# EAGLE design mainboard.pa3 (EAGLE 4.11)
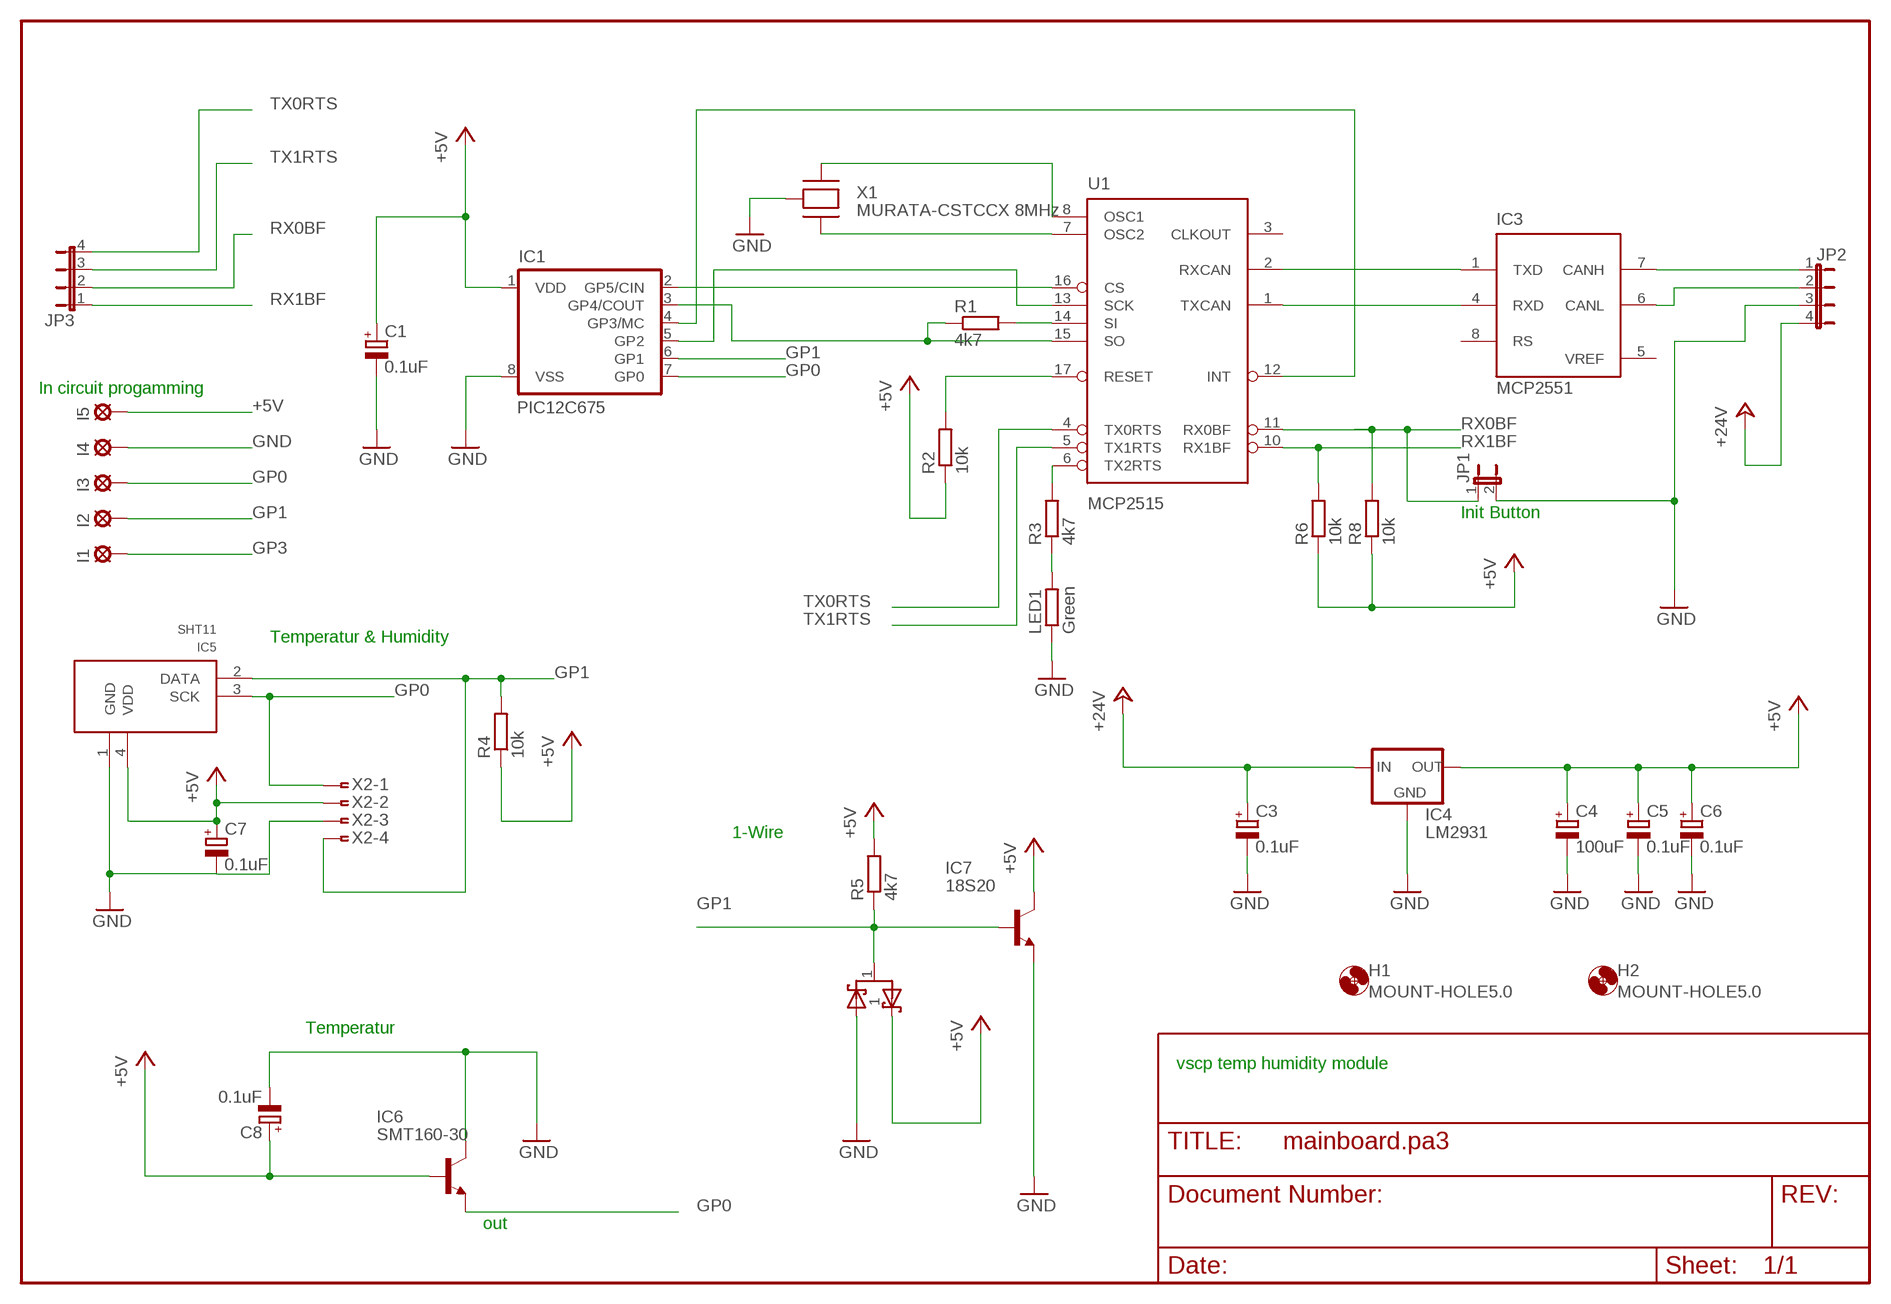
[diagram p0: schematic, sheet 1]

## Parts
C1  0.1uF  CPOL-EUCT3216  [CT3216]
C3  0.1uF  CPOL-EUCT3216  [CT3216]
C4  100uF  CPOL-EUCT7343  [CT7343]
C5  0.1uF  CPOL-EUCT3216  [CT3216]
C6  0.1uF  CPOL-EUCT3216  [CT3216]
C7  0.1uF  CPOL-EUCT3216  [CT3216]
C8  0.1uF  CPOL-EUCT3216  [CT3216]
H1  MOUNT-HOLE5.0  [5,0]
H2  MOUNT-HOLE5.0  [5,0]
I1  LSP10  [LSP10]
I2  LSP10  [LSP10]
I3  LSP10  [LSP10]
I4  LSP10  [LSP10]
I5  LSP10  [LSP10]
IC1  PIC12C675  PIC12C672SM  [SO-08M]
IC3  MCP2551  MCP2551SN  [SO-08]
IC4  LM2931  78LXX  [78LXX]
IC5  SHT11  SHT1X  [SHT1X]
IC6  SMT160-30  BC547  [TO92]
IC7  18S20  BC547  [TO92]
JP1  JP1E  [JP1]
JP2  JP4E  [JP4]
JP3  JP4E  [JP4]
LED1  Green  R-EU_R1206  [R1206]
R1  4k7  R-EU_R0805  [R0805]
R2  10k  R-EU_R0805  [R0805]
R3  4k7  R-EU_R0805  [R0805]
R4  10k  R-EU_R0805  [R0805]
R5  4k7  R-EU_R0805  [R0805]
R6  10k  R-EU_R0805  [R0805]
R8  10k  R-EU_R0805  [R0805]
U1  MCP2515  MCP2510SO  [SO-18W]
U$1  BAT54SCT  [SOT23]
X1  MURATA-CSTCCX 8MHz  MURATA-CSTCCX  [RESONATOR-MURATA-CSTCCX]
X2  FTOP-4  [FTOP-4]

## Nets
+5V: C1.+ C4.+ C5.+ C6.+ C7.+ C8.+ I5.MP IC1.1(VDD) IC4.OUT IC5.4(VDD) IC6.2(B) IC7.3(C) R2.1 R4.1 R5.2 R6.1 R8.1 U$1.2 X2.2
+24V: C3.+ IC4.IN JP2.4
GND: C1.- C3.- C4.- C5.- C6.- C7.- C8.- I4.MP IC1.8(VSS) IC4.GND IC5.1(GND) IC6.3(C) IC7.1(E) JP1.2 JP2.3 LED1.1 U$1.3 X1.3(GND) X2.3
GP0: I3.MP IC1.7(GP0) IC5.3(SCK) IC6.1(E) X2.1
GP1: I2.MP IC1.6(GP1) IC5.2(DATA) IC7.2(B) R4.2 R5.1 U$1.1 X2.4
GP2: IC1.5(GP2) U1.13(SCK)
GP3: I1.MP IC1.4(GP3/MC) U1.12(INT)
GP4: IC1.3(GP4/COUT) R1.1 U1.15(SO)
GP5: IC1.2(GP5/CIN) U1.16(CS)
N$1: IC3.1(TXD) U1.2(RXCAN)
N$2: IC3.4(RXD) U1.1(TXCAN)
N$3: R2.2 U1.17(RESET)
N$4: IC3.7(CANH) JP2.1
N$5: IC3.6(CANL) JP2.2
N$7: R1.2 U1.14(SI)
N$10: LED1.2 R3.1
OSC1: U1.8(OSC1) X1.2(XTIN)
OSC2: U1.7(OSC2) X1.1(XTOUT)
RX0BF: JP1.1 JP3.2 R8.2 U1.11(RX0BF)
RX1BF: JP3.1 R6.2 U1.10(RX1BF)
TX0RTS: JP3.4 U1.4(TX0RTS)
TX1RTS: JP3.3 U1.5(TX1RTS)
TX2RTS: R3.2 U1.6(TX2RTS)
Unconnected: IC3.8(RS) U1.3(CLKOUT)

## Notes on the sheet
- In circuit progamming
- Init Button
- Temperatur & Humidity
- 1-Wire
- Temperatur
- vscp temp humidity module
- out

## Power pins joined to a net without a drawn wire
VDD: IC3.3(VDD) U1.18(VDD)
VREF: IC3.5(VREF)
VSS: IC3.2(VSS) U1.9(VSS)

## Library data of the parts
C1 C3-C8 = rcl:CPOL-EU: POLARIZED CAPACITOR, European symbol
H1 H2 = holes:MOUNT-HOLE: MOUNTING HOLE with drill center marker
I1-I5 = solpad:LSP10: SOLDER PAD drill 1.0 mm, distributor Buerklin, 12H555
IC1 = microchip:PIC12C*?: MICROCONTROLLER
IC3 = microchip_can:MCP2551: High Speed CAN tranceiver
IC4 = v-reg:78LXX: VOLTAGE REGULATOR
IC5 = eurosource_ftdi:SHT1X
IC6 IC7 = transistor-npn:BC547*: NPN Transistor
JP1 = jumper:JP1E: JUMPER
JP2 JP3 = jumper:JP4E: JUMPER
LED1 R1-R6 R8 = rcl:R-EU_: RESISTOR, European symbol
U1 = microchip_can:MCP2510
U$1 = dallas:BAT54S
X1 = eurosource_ftdi:MURATA-CSTCCX
X2 = con-amp:FTOP-4: AMP connector

## Board
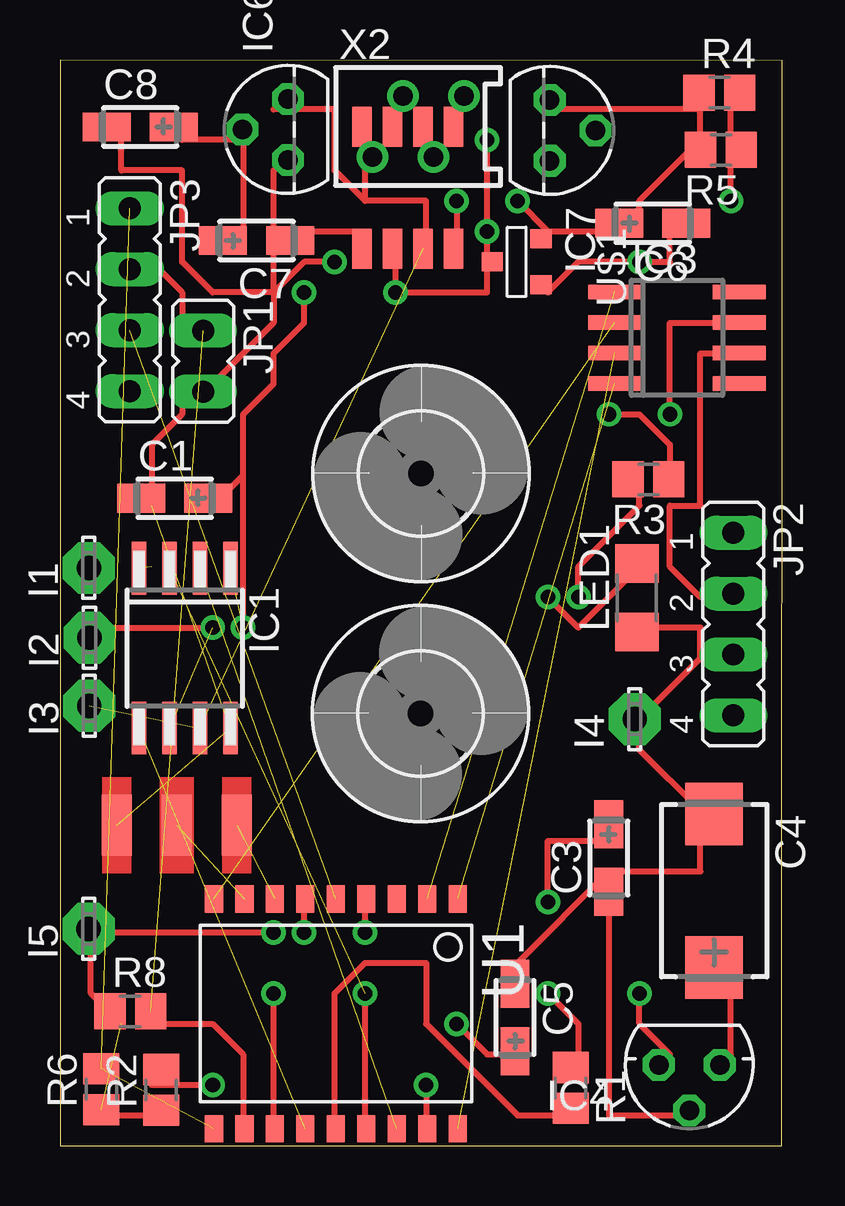
[diagram p1: board, top side]
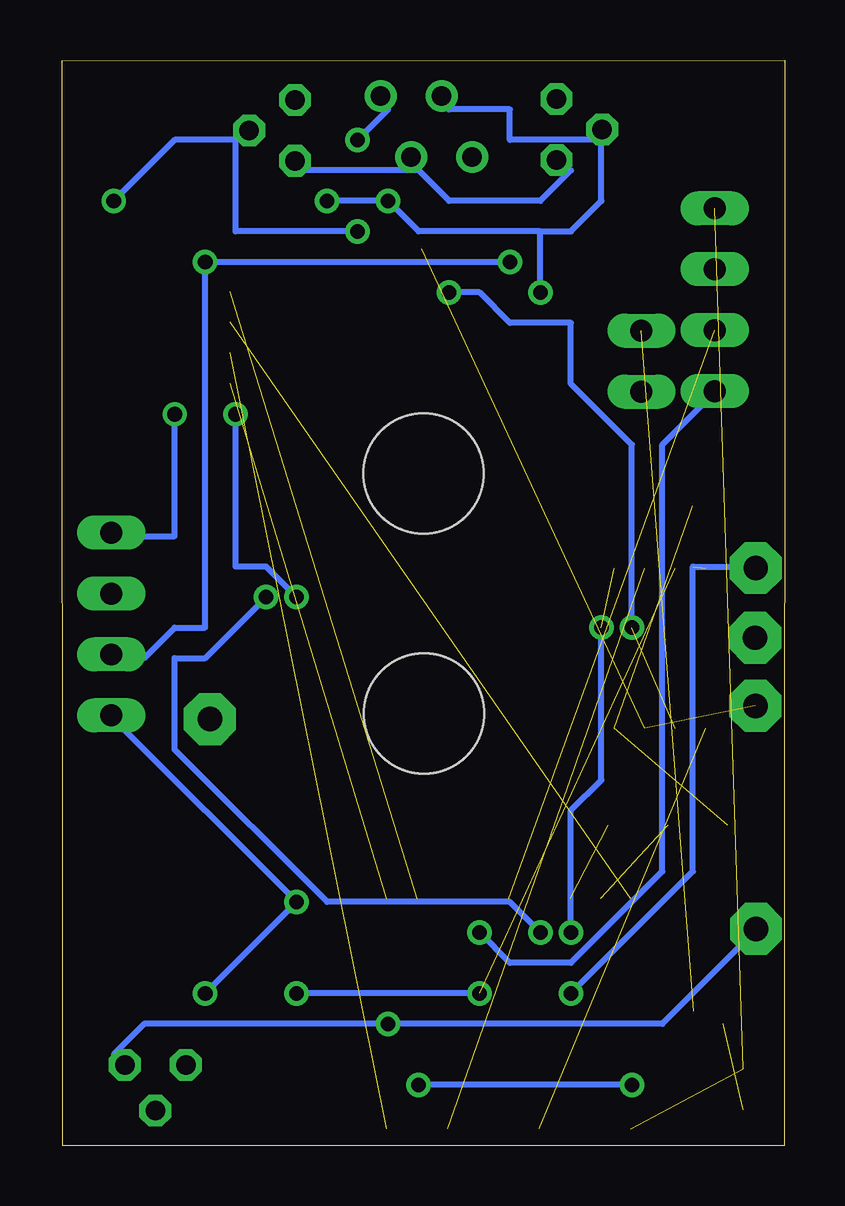
[diagram p2: board, bottom side, seen from below]

Size 30.1 x 45.24 mm. Coordinates in mm from the lower left corner, seen from the top.
Outline: 0.01,0 30.08,0 30.1,45.21 0,45.25 0.01,0
Copper layers (1*16): Top 0.035mm / dielectric 1.5mm / Bottom 0.035mm
Design rules "default": minimum track width 10mil, minimum drill 24mil, track to track 8mil, track to pad 8mil, pad to pad 8mil, via to via 8mil, smd to smd 8mil, copper to edge 40mil, drill to drill 8mil, minimum pad ring 10mil, minimum via ring 8mil, stop-mask expansion 4mil, vias tented up to drill 0mil, thermal gap 10mil

### Footprints (pad centres in the part's own frame; a part is rotated, then mirrored left to right if it is on the bottom)
CT3216 = smd 2 x 1.2: + 1.4,0; - -1.4,0
CT7343 = smd 2.6 x 2.4: + 3.2,0; - -3.2,0
5,0 = hole 5: 0,0
LSP10 = drill 1.016 pad 2.159 octagon: MP 0,0
SO-08M = smd 0.6 x 2.2: 1 -1.905,-3.33; 2 -0.635,-3.33; 3 0.635,-3.33; 4 1.905,-3.33; 5 1.905,3.33; 6 0.635,3.33; 7 -0.635,3.33; 8 -1.905,3.33
SO-08 = smd 0.6 x 2.2: 1 -1.905,-2.6; 2 -0.635,-2.6; 3 0.635,-2.6; 4 1.905,-2.6; 5 1.905,2.6; 6 0.635,2.6; 7 -0.635,2.6; 8 -1.905,2.6
78LXX = drill 0.813 octagon: GND 0,1.905; IN 1.27,0; OUT -1.27,0
SHT1X = smd 1.676 x 0.813: 1 -2.54,2.54; 2 -2.54,1.27; 3 -2.54,0; 4 -2.54,-1.27; P$5 2.54,2.54; P$6 2.54,1.27; P$7 2.54,0; P$8 2.54,-1.27
TO92 = drill 0.813 octagon: 1 1.27,0; 2 0,1.905; 3 -1.27,0
JP1 = drill 0.914 long: 1 0,-1.27; 2 0,1.27
JP4 = drill 0.914 long: 1 -3.81,0; 2 -1.27,0; 3 1.27,0; 4 3.81,0
R1206 = smd 1.6 x 1.803: 1 -1.422,0; 2 1.422,0
R0805 = smd 1.3 x 1.5: 1 -0.85,0; 2 0.85,0
SO-18W = smd 0.762 x 1.143: 1 -5.08,-4.788; 2 -3.81,-4.788; 3 -2.54,-4.788; 4 -1.27,-4.788; 5 0,-4.788; 6 1.27,-4.788; 7 2.54,-4.788; 8 3.81,-4.788; 9 5.08,-4.788; 10 5.08,4.788; 11 3.81,4.788; 12 2.54,4.788; 13 1.27,4.788; 14 0,4.788; 15 -1.27,4.788; 16 -2.54,4.788; 17 -3.81,4.788; 18 -5.08,4.788
SOT23 = smd 0.787 x 0.889: 1 0.025,-1.016; 2 -0.94,1.016; 3 0.991,1.016
RESONATOR-MURATA-CSTCCX = smd 2.54 x 1.27: 1 0,2.4; 2 0,-0.1; 3 0,-2.6
FTOP-4 = drill 0.813 round: 1 -1.905,-1.27; 2 -0.635,1.27; 3 0.635,-1.27; 4 1.905,1.27

### Placement (x,y rotation side)
C1  4.78,26.98 0 top
C3  22.87,12 90 top
C4  27.25,10.63 270 top
C5  18.96,5.35 270 top
C6  24.7,38.45 180 top
C7  8.19,37.72 180 top
C8  3.34,42.46 0 top
H1  15.02,18.02 0 top
H2  15.04,28.02 0 top
I1  1.2,24.08 90 top
I2  1.23,21.17 90 top
I3  1.22,18.33 90 top
I4  23.95,17.78 90 top
I5  1.19,9.04 90 top
IC1  5.2,20.74 180 top
IC3  25.71,33.68 270 top
IC4  26.22,3.37 180 top
IC5  15.13,39.92 90 top
IC6  9.51,42.35 90 top
IC7  20.4,42.31 270 top
JP1  5.97,32.7 180 top
JP2  28.06,21.74 270 top
JP3  2.91,35.26 270 top
LED1  24.04,22.84 90 top
R1  21.28,2.41 270 top
R2  4.21,2.33 90 top
R3  24.52,27.77 180 top
R4  27.47,43.88 0 top
R5  27.54,41.5 180 top
R6  1.72,2.36 90 top
R8  2.93,5.6 0 top
U1  11.49,5.5 180 top
U$1  19.03,36.86 270 top
X1  4.96,13.36 270 top
X2  14.92,42.48 0 top

### Tracks (layer width: path | path; a pad name or v marks a point on that pad's centre or on a via)
+5V  (via drill 0.61)  (2 unrouted)
  Top 0.254: 1.28,8.89 1.28,6.35 2.55,5.08 R8.1 | v16.52,5.08 17.79,3.81 19.06,3.81 C5.+ | C4.+ 27.95,6.35 27.95,3.81 IC4.OUT | 26.68,41.91 26.68,43.18 | 20.33,38.1 22.87,38.1 C6.+ 24.14,38.1 24.14,39.37 26.68,41.91 | 26.68,41.91 R5.2 | 26.68,43.18 20.33,43.18 IC7.3 | 26.68,43.18 R4.1 | v16.52,39.37 16.52,38.1 IC5.4 | 7.63,27.94 6.36,26.67 C1.+ | 7.63,27.94 7.63,30.48 8.9,31.75 8.9,33.02 10.17,34.29 v10.17,35.56 | 7.63,41.91 5.09,41.91 C8.+ | 7.63,41.91 7.63,38.1 C7.+ | IC6.2 7.63,41.91 | v19.06,39.37 20.33,38.1 | 20.33,38.1 U$1.2 | 1.28,8.89 v8.9,8.89 | v7.63,21.59 7.63,27.94 | 1.28,8.89 I5.MP | R6.1 1.28,1.27 3.82,1.27 R2.1
  Bottom 0.254: IC4.OUT 27.95,3.81 26.68,5.08 v16.52,5.08 5.09,5.08 1.28,8.89 I5.MP | 10.17,38.1 8.9,38.1 7.63,39.37 7.63,41.91 | 10.17,38.1 15.25,38.1 v16.52,39.37 v19.06,39.37 | v10.17,35.56 10.17,38.1 | 7.63,41.91 11.44,41.91 11.44,43.18 13.98,43.18 X2.2 | 7.63,41.91 IC6.2 | v8.9,8.89 8.9,13.97 7.63,15.24 v7.63,21.59
+24V  (via drill 0.61)
  Top 0.254: v20.33,10.16 20.33,12.7 22.87,12.7 C3.+ | v24.14,6.35 24.14,5.08 25.41,3.81 IC4.IN
  Bottom 0.254: JP2.4 27.95,17.78 v20.33,10.16 v24.14,6.35
GND  (via drill 0.61)  (2 unrouted)
  Top 0.254: C1.- 3.82,26.67 3.82,29.21 5.09,30.48 5.09,31.75 JP1.2 6.36,31.75 8.9,34.29 8.9,35.56 | IC5.1 12.71,38.1 10.17,38.1 C7.- 8.9,38.1 | 8.9,35.56 6.36,35.56 5.09,36.83 5.09,40.64 2.55,40.64 2.55,41.91 C8.- | 8.9,35.56 8.9,38.1 | 8.9,38.1 8.9,40.64 IC6.3 | 22.87,11.43 19.06,7.62 C5.- | IC4.GND 26.68,1.27 22.87,1.27 22.87,10.16 C3.- 22.87,11.43 | U$1.3 20.33,35.56 21.6,36.83 v24.14,36.83 25.41,36.83 25.41,38.1 C6.- | 26.68,20.32 26.68,21.59 24.14,21.59 LED1.1 | 24.14,17.78 24.14,16.51 26.68,13.97 C4.- 26.68,12.7 26.68,11.43 22.87,11.43 | 24.14,17.78 26.68,20.32 | 26.68,20.32 JP2.3 | 24.14,17.78 I4.MP | 8.9,35.56 10.17,36.83 v11.44,36.83
  Bottom 0.254: 15.25,40.64 20.33,40.64 IC7.1 | 15.25,40.64 13.98,39.37 10.17,39.37 8.9,40.64 IC6.3 | 15.25,40.64 X2.3 | JP2.3 26.68,20.32 25.41,21.59 24.14,21.59 v24.14,36.83 v11.44,36.83
GP0  (2 unrouted)
  Top 0.254: 12.71,39.37 15.25,39.37 15.25,38.1 IC5.3 | 12.71,39.37 12.71,40.64 X2.1 | 12.71,39.37 11.44,40.64 11.44,43.18 8.9,43.18 IC6.1
GP1  (via drill 0.61)  (1 unrouted)
  Top 0.254: 27.95,41.91 27.95,43.18 R4.2 | v27.95,39.37 27.95,41.91 | 27.95,41.91 R5.1 | 17.79,36.83 17.79,35.56 v13.98,35.56 13.98,36.83 IC5.2 | 17.79,36.83 v17.79,38.1 v17.79,41.91 | 17.79,36.83 U$1.1 | v6.36,21.59 1.28,21.59 I2.MP
  Bottom 0.254: v27.95,39.37 25.41,41.91 22.87,41.91 | v17.79,41.91 16.52,43.18 X2.4 | v6.36,21.59 6.36,29.21 8.9,31.75 8.9,34.29 11.44,34.29 12.71,35.56 v13.98,35.56 | 22.87,41.91 22.87,38.1 v17.79,38.1 | 22.87,41.91 IC7.2
GP2  (1 unrouted)
GP3  (via drill 0.61)  (1 unrouted)
  Top 0.254: v8.9,6.35 8.9,1.27 U1.12
  Bottom 0.254: v8.9,6.35 3.82,11.43 3.82,24.13 1.28,24.13 I1.MP
GP4  (via drill 0.61)  (1 unrouted)
  Top 0.254: v12.71,6.35 12.71,1.27 U1.15 | v20.33,6.35 21.6,5.08 21.6,3.81 R1.1
  Bottom 0.254: v12.71,6.35 v20.33,6.35
GP5  (1 unrouted)
N$1  (1 unrouted)
N$2  (1 unrouted)
N$3  (via drill 0.61)
  Top 0.254: v15.25,2.54 15.25,1.27 U1.17 | v6.36,2.54 3.82,2.54 R2.2
  Bottom 0.254: v6.36,2.54 v15.25,2.54
N$4  (via drill 0.61)
  Top 0.254: v25.41,30.48 25.41,34.29 27.95,34.29 IC3.7
  Bottom 0.254: v25.41,30.48 25.41,25.4 26.68,25.4 JP2.1
N$5
  Top 0.254: IC3.6 27.95,33.02 26.68,33.02 26.68,26.67 25.41,26.67 25.41,24.13 26.68,22.86 JP2.2
N$7
  Top 0.254: U1.14 11.44,1.27 11.44,6.35 12.71,7.62 15.25,7.62 15.25,5.08 19.06,1.27 21.6,1.27 R1.2
N$10  (via drill 0.61)
  Top 0.254: v22.87,30.48 24.14,30.48 25.41,29.21 25.41,27.94 R3.1 | v20.33,22.86 21.6,21.59 24.14,24.13 LED1.2
  Bottom 0.254: v22.87,30.48 22.87,24.13 21.6,24.13 v20.33,22.86
OSC1  (1 unrouted)
OSC2  (1 unrouted)
RX0BF  (1 unrouted)
  Top 0.254: U1.11 7.63,1.27 7.63,3.81 6.36,5.08 3.82,5.08 R8.2 | JP3.2 3.82,36.83 5.09,35.56 5.09,34.29 JP1.1
RX1BF  (2 unrouted)
TX0RTS  (via drill 0.61)
  Top 0.254: v12.71,8.89 12.71,10.16 U1.4
  Bottom 0.254: v12.71,8.89 11.44,7.62 8.9,7.62 5.09,11.43 5.09,29.21 2.55,31.75 JP3.4
TX1RTS  (1 unrouted)
TX2RTS  (via drill 0.61)
  Top 0.254: v10.17,8.89 10.17,10.16 U1.6 | v21.6,22.86 21.6,24.13 24.14,26.67 24.14,27.94 R3.2
  Bottom 0.254: v10.17,8.89 11.44,10.16 19.06,10.16 25.41,16.51 25.41,20.32 24.14,20.32 v21.6,22.86
VDD  (1 unrouted)
VSS  (1 unrouted)